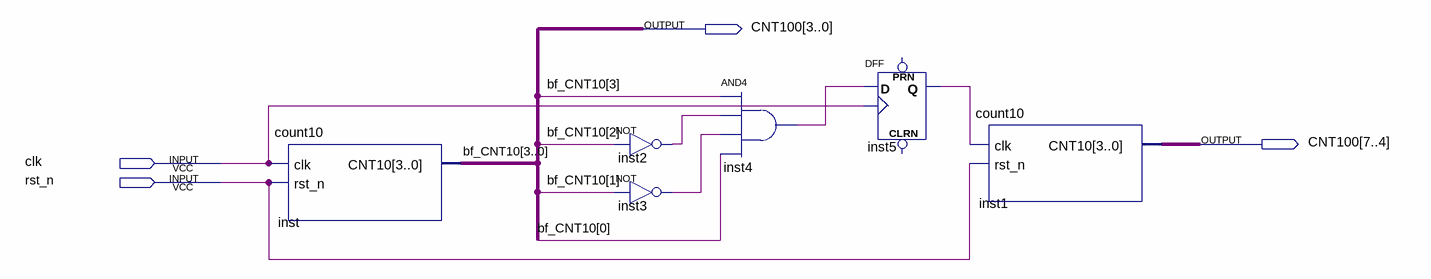
[diagram p0: schematic sheet]
// Quartus schematic chap5_chae.bdf as structural Verilog: 6 symbols, 4 pins
module chap5_chae (
  input  clk,
  input  rst_n,
  output [7:0] CNT100
);

  wire inst2_out, inst3_out, inst4_out, inst5_q;

  count10 inst (.clk(clk), .rst_n(rst_n), .CNT10(CNT100[3:0]));
  not inst2 (inst2_out, CNT100[2]);
  not inst3 (inst3_out, CNT100[1]);
  and inst4 (inst4_out, CNT100[3], inst2_out, inst3_out, CNT100[0]);
  DFF inst5 (.CLK(clk), .D(inst4_out), .Q(inst5_q));  // open: CLRN, PRN
  count10 inst1 (.clk(inst5_q), .rst_n(rst_n), .CNT10(CNT100[7:4]));

  // Other names for the same wires on the sheet: bf_CNT10[3:0] = CNT100[3:0]
endmodule
